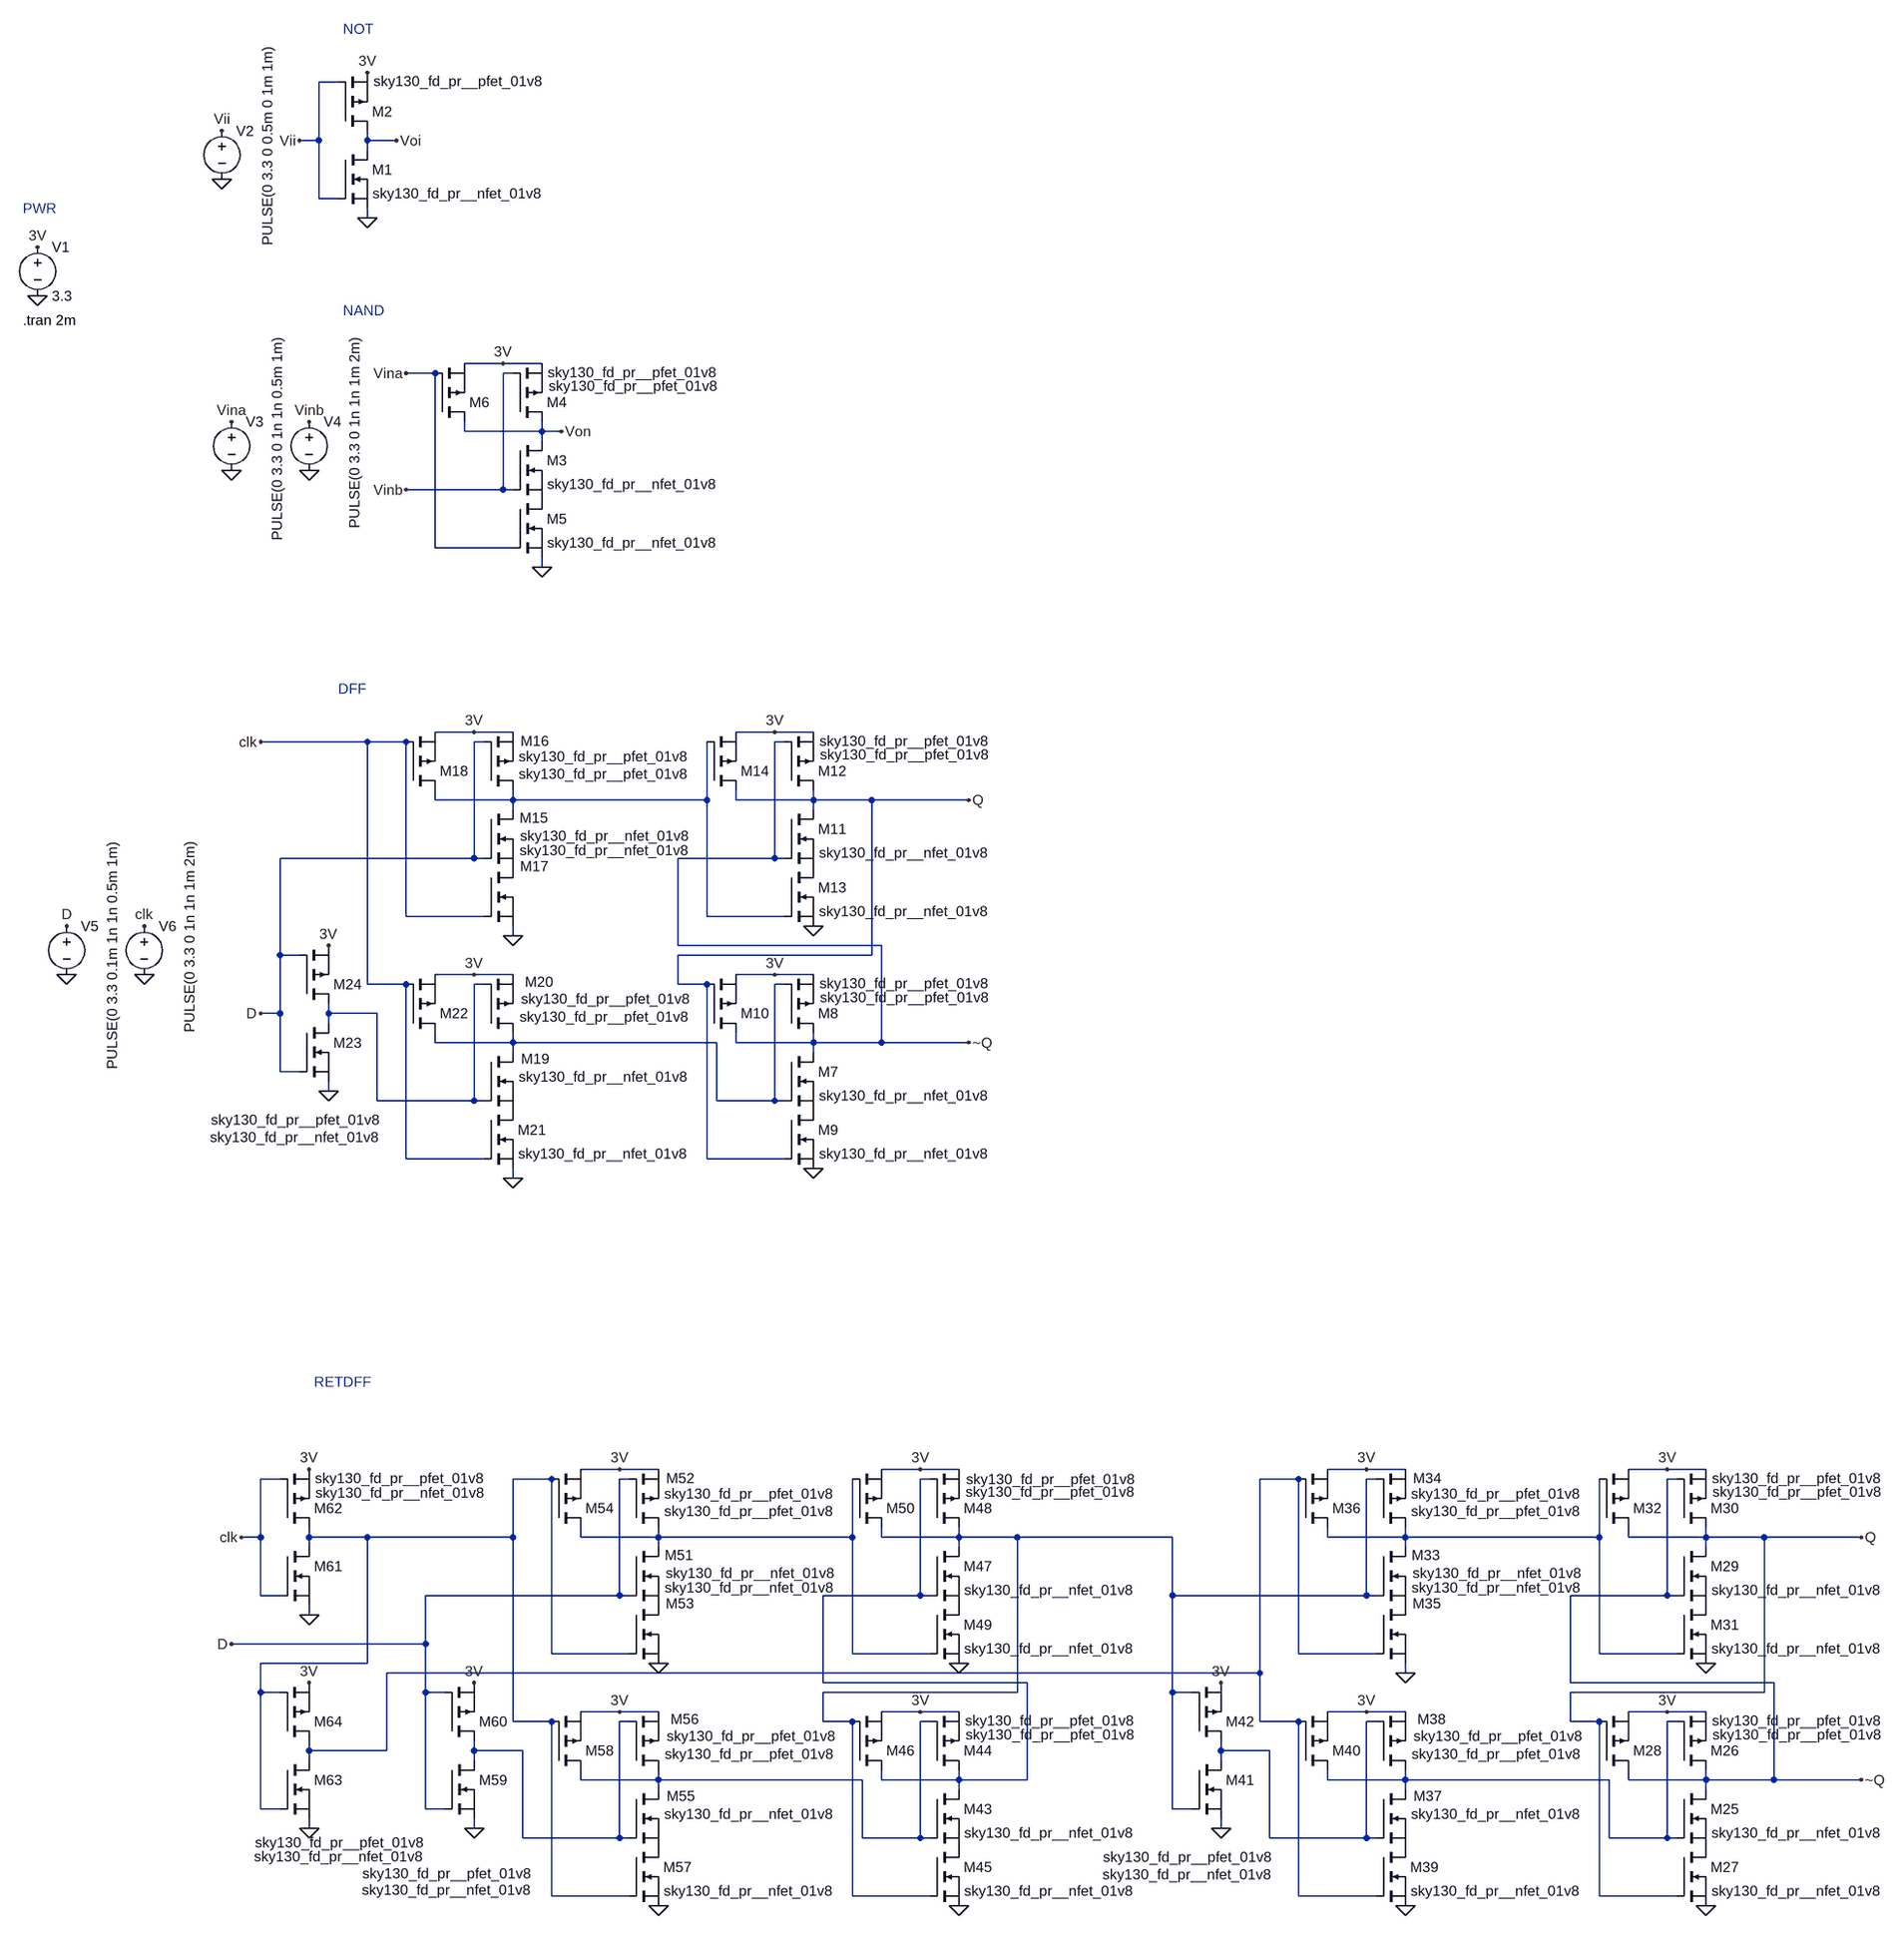
[diagram p0: schematic Digital.asc]
Digital.asc, the LTspice schematic file:
Version 4
SHEET 1 2436 2916
WIRE -144 -112 -176 -112
WIRE -176 -16 -176 -112
WIRE -176 -16 -208 -16
WIRE -96 -16 -96 -32
WIRE -48 -16 -96 -16
WIRE -96 0 -96 -16
WIRE -176 80 -176 -16
WIRE -144 80 -176 80
WIRE -96 112 -96 96
WIRE 128 352 64 352
WIRE 192 352 128 352
WIRE 16 368 -32 368
WIRE 144 368 128 368
WIRE 64 464 64 448
WIRE 192 464 192 448
WIRE 192 464 64 464
WIRE 224 464 192 464
WIRE 192 480 192 464
WIRE 128 560 128 368
WIRE 128 560 -32 560
WIRE 144 560 128 560
WIRE 16 656 16 368
WIRE 144 656 16 656
WIRE 192 688 192 672
WIRE 80 960 16 960
WIRE 144 960 80 960
WIRE 576 960 512 960
WIRE 640 960 576 960
WIRE -96 976 -272 976
WIRE -32 976 -96 976
WIRE 96 976 80 976
WIRE 592 976 576 976
WIRE 16 1072 16 1056
WIRE 144 1072 144 1056
WIRE 144 1072 16 1072
WIRE 464 1072 464 976
WIRE 464 1072 144 1072
WIRE 512 1072 512 1056
WIRE 640 1072 640 1056
WIRE 640 1072 512 1072
WIRE 736 1072 640 1072
WIRE 896 1072 736 1072
WIRE 144 1088 144 1072
WIRE 640 1088 640 1072
WIRE 80 1168 80 976
WIRE 80 1168 -240 1168
WIRE 96 1168 80 1168
WIRE 576 1168 576 976
WIRE 576 1168 416 1168
WIRE 592 1168 576 1168
WIRE -32 1264 -32 976
WIRE 96 1264 -32 1264
WIRE 464 1264 464 1072
WIRE 592 1264 464 1264
WIRE 144 1296 144 1280
WIRE 416 1312 416 1168
WIRE 752 1312 416 1312
WIRE -240 1328 -240 1168
WIRE -208 1328 -240 1328
WIRE 736 1328 736 1072
WIRE 736 1328 416 1328
WIRE 80 1360 16 1360
WIRE 144 1360 80 1360
WIRE 576 1360 512 1360
WIRE 640 1360 576 1360
WIRE -96 1376 -96 976
WIRE -32 1376 -96 1376
WIRE 96 1376 80 1376
WIRE 416 1376 416 1328
WIRE 464 1376 416 1376
WIRE 592 1376 576 1376
WIRE -240 1424 -240 1328
WIRE -240 1424 -272 1424
WIRE -160 1424 -160 1408
WIRE -80 1424 -160 1424
WIRE -160 1440 -160 1424
WIRE 16 1472 16 1456
WIRE 144 1472 144 1456
WIRE 144 1472 16 1472
WIRE 480 1472 144 1472
WIRE 512 1472 512 1456
WIRE 640 1472 640 1456
WIRE 640 1472 512 1472
WIRE 752 1472 752 1312
WIRE 752 1472 640 1472
WIRE 896 1472 752 1472
WIRE 144 1488 144 1472
WIRE 640 1488 640 1472
WIRE -240 1520 -240 1424
WIRE -208 1520 -240 1520
WIRE -160 1552 -160 1536
WIRE -80 1568 -80 1424
WIRE 80 1568 80 1376
WIRE 80 1568 -80 1568
WIRE 96 1568 80 1568
WIRE 480 1568 480 1472
WIRE 576 1568 576 1376
WIRE 576 1568 480 1568
WIRE 592 1568 576 1568
WIRE -32 1664 -32 1376
WIRE 96 1664 -32 1664
WIRE 464 1664 464 1376
WIRE 592 1664 464 1664
WIRE 144 1696 144 1680
WIRE 320 2176 256 2176
WIRE 384 2176 320 2176
WIRE 816 2176 752 2176
WIRE 880 2176 816 2176
WIRE 1552 2176 1488 2176
WIRE 1616 2176 1552 2176
WIRE 2048 2176 1984 2176
WIRE 2112 2176 2048 2176
WIRE -240 2192 -272 2192
WIRE 208 2192 144 2192
WIRE 336 2192 320 2192
WIRE 832 2192 816 2192
WIRE 1440 2192 1376 2192
WIRE 1568 2192 1552 2192
WIRE 2064 2192 2048 2192
WIRE -272 2288 -272 2192
WIRE -272 2288 -304 2288
WIRE -192 2288 -192 2272
WIRE -96 2288 -192 2288
WIRE 144 2288 144 2192
WIRE 144 2288 -96 2288
WIRE 256 2288 256 2272
WIRE 384 2288 384 2272
WIRE 384 2288 256 2288
WIRE 704 2288 704 2192
WIRE 704 2288 384 2288
WIRE 752 2288 752 2272
WIRE 880 2288 880 2272
WIRE 880 2288 752 2288
WIRE 976 2288 880 2288
WIRE 1232 2288 976 2288
WIRE 1488 2288 1488 2272
WIRE 1616 2288 1616 2272
WIRE 1616 2288 1488 2288
WIRE 1936 2288 1936 2192
WIRE 1936 2288 1616 2288
WIRE 1984 2288 1984 2272
WIRE 2112 2288 2112 2272
WIRE 2112 2288 1984 2288
WIRE 2208 2288 2112 2288
WIRE 2368 2288 2208 2288
WIRE -192 2304 -192 2288
WIRE 384 2304 384 2288
WIRE 880 2304 880 2288
WIRE 1616 2304 1616 2288
WIRE 2112 2304 2112 2288
WIRE -272 2384 -272 2288
WIRE -240 2384 -272 2384
WIRE 320 2384 320 2192
WIRE 320 2384 0 2384
WIRE 336 2384 320 2384
WIRE 816 2384 816 2192
WIRE 816 2384 656 2384
WIRE 832 2384 816 2384
WIRE 1232 2384 1232 2288
WIRE 1552 2384 1552 2192
WIRE 1552 2384 1232 2384
WIRE 1568 2384 1552 2384
WIRE 2048 2384 2048 2192
WIRE 2048 2384 1888 2384
WIRE 2064 2384 2048 2384
WIRE -192 2416 -192 2400
WIRE 0 2464 0 2384
WIRE 0 2464 -320 2464
WIRE 208 2480 208 2192
WIRE 336 2480 208 2480
WIRE 704 2480 704 2288
WIRE 832 2480 704 2480
WIRE 1440 2480 1440 2192
WIRE 1568 2480 1440 2480
WIRE 1936 2480 1936 2288
WIRE 2064 2480 1936 2480
WIRE -96 2496 -96 2288
WIRE -96 2496 -272 2496
WIRE 1376 2512 1376 2192
WIRE 1376 2512 -64 2512
WIRE 1616 2512 1616 2496
WIRE 656 2528 656 2384
WIRE 992 2528 656 2528
WIRE 1888 2528 1888 2384
WIRE 2224 2528 1888 2528
WIRE -272 2544 -272 2496
WIRE -240 2544 -272 2544
WIRE 0 2544 0 2464
WIRE 32 2544 0 2544
WIRE 976 2544 976 2288
WIRE 976 2544 656 2544
WIRE 1232 2544 1232 2384
WIRE 1264 2544 1232 2544
WIRE 2208 2544 2208 2288
WIRE 2208 2544 1888 2544
WIRE 320 2576 256 2576
WIRE 384 2576 320 2576
WIRE 816 2576 752 2576
WIRE 880 2576 816 2576
WIRE 1552 2576 1488 2576
WIRE 1616 2576 1552 2576
WIRE 2048 2576 1984 2576
WIRE 2112 2576 2048 2576
WIRE 144 2592 144 2288
WIRE 208 2592 144 2592
WIRE 336 2592 320 2592
WIRE 656 2592 656 2544
WIRE 704 2592 656 2592
WIRE 832 2592 816 2592
WIRE 1376 2592 1376 2512
WIRE 1440 2592 1376 2592
WIRE 1568 2592 1552 2592
WIRE 1888 2592 1888 2544
WIRE 1936 2592 1888 2592
WIRE 2064 2592 2048 2592
WIRE -192 2640 -192 2624
WIRE -64 2640 -64 2512
WIRE -64 2640 -192 2640
WIRE 80 2640 80 2624
WIRE 160 2640 80 2640
WIRE 1312 2640 1312 2624
WIRE 1392 2640 1312 2640
WIRE -192 2656 -192 2640
WIRE 80 2656 80 2640
WIRE 1312 2656 1312 2640
WIRE 256 2688 256 2672
WIRE 384 2688 384 2672
WIRE 384 2688 256 2688
WIRE 720 2688 384 2688
WIRE 752 2688 752 2672
WIRE 880 2688 880 2672
WIRE 880 2688 752 2688
WIRE 992 2688 992 2528
WIRE 992 2688 880 2688
WIRE 1488 2688 1488 2672
WIRE 1616 2688 1616 2672
WIRE 1616 2688 1488 2688
WIRE 1952 2688 1616 2688
WIRE 1984 2688 1984 2672
WIRE 2112 2688 2112 2672
WIRE 2112 2688 1984 2688
WIRE 2224 2688 2224 2528
WIRE 2224 2688 2112 2688
WIRE 2368 2688 2224 2688
WIRE 384 2704 384 2688
WIRE 880 2704 880 2688
WIRE 1616 2704 1616 2688
WIRE 2112 2704 2112 2688
WIRE -272 2736 -272 2544
WIRE -240 2736 -272 2736
WIRE 0 2736 0 2544
WIRE 32 2736 0 2736
WIRE 1232 2736 1232 2544
WIRE 1264 2736 1232 2736
WIRE -192 2768 -192 2752
WIRE 80 2768 80 2752
WIRE 1312 2768 1312 2752
WIRE 160 2784 160 2640
WIRE 320 2784 320 2592
WIRE 320 2784 160 2784
WIRE 336 2784 320 2784
WIRE 720 2784 720 2688
WIRE 816 2784 816 2592
WIRE 816 2784 720 2784
WIRE 832 2784 816 2784
WIRE 1392 2784 1392 2640
WIRE 1552 2784 1552 2592
WIRE 1552 2784 1392 2784
WIRE 1568 2784 1552 2784
WIRE 1952 2784 1952 2688
WIRE 2048 2784 2048 2592
WIRE 2048 2784 1952 2784
WIRE 2064 2784 2048 2784
WIRE 208 2880 208 2592
WIRE 336 2880 208 2880
WIRE 704 2880 704 2592
WIRE 832 2880 704 2880
WIRE 1440 2880 1440 2592
WIRE 1568 2880 1440 2880
WIRE 1936 2880 1936 2592
WIRE 2064 2880 1936 2880
FLAG -208 -16 Vii
FLAG -96 -128 3V
FLAG -48 -16 Voi
FLAG -96 112 0
FLAG -640 240 0
FLAG -640 160 3V
FLAG -336 48 0
FLAG -336 -32 Vii
FLAG -32 368 Vina
FLAG 128 352 3V
FLAG 224 464 Von
FLAG 192 688 0
FLAG -320 528 0
FLAG -320 448 Vina
FLAG -192 528 0
FLAG -192 448 Vinb
FLAG -32 560 Vinb
FLAG 576 1360 3V
FLAG 896 1472 ~Q
FLAG 640 1680 0
FLAG 576 960 3V
FLAG 896 1072 Q
FLAG 640 1280 0
FLAG 80 960 3V
FLAG 144 1296 0
FLAG 80 1360 3V
FLAG 144 1696 0
FLAG -272 1424 D
FLAG -160 1312 3V
FLAG -160 1552 0
FLAG -272 976 clk
FLAG -592 1360 0
FLAG -592 1280 D
FLAG -464 1360 0
FLAG -464 1280 clk
FLAG 2048 2576 3V
FLAG 2368 2688 ~Q
FLAG 2112 2896 0
FLAG 2048 2176 3V
FLAG 2368 2288 Q
FLAG 2112 2496 0
FLAG 1552 2176 3V
FLAG 1616 2512 0
FLAG 1552 2576 3V
FLAG 1616 2896 0
FLAG 1312 2528 3V
FLAG 1312 2768 0
FLAG 816 2576 3V
FLAG 880 2896 0
FLAG 816 2176 3V
FLAG 880 2496 0
FLAG 320 2176 3V
FLAG 320 2576 3V
FLAG 384 2896 0
FLAG -320 2464 D
FLAG 80 2528 3V
FLAG 80 2768 0
FLAG -192 2176 3V
FLAG -192 2416 0
FLAG -192 2528 3V
FLAG -192 2768 0
FLAG -304 2288 clk
FLAG 384 2496 0
SYMBOL nmos -144 0 R0
WINDOW 3 57 71 Left 2
SYMATTR Value sky130_fd_pr__nfet_01v8
SYMATTR InstName M1
SYMBOL pmos -144 -32 M180
WINDOW 3 58 82 Left 2
SYMATTR Value sky130_fd_pr__pfet_01v8
SYMATTR InstName M2
SYMBOL voltage -640 144 R0
WINDOW 123 0 0 Left 0
WINDOW 39 0 0 Left 0
SYMATTR InstName V1
SYMATTR Value 3.3
SYMBOL voltage -336 -48 R0
WINDOW 3 75 -125 VRight 2
WINDOW 123 0 0 Left 0
WINDOW 39 0 0 Left 0
SYMATTR Value PULSE(0 3.3 0 0.5m 0 1m 1m)
SYMATTR InstName V2
SYMBOL nmos 144 480 R0
WINDOW 3 57 71 Left 2
SYMATTR Value sky130_fd_pr__nfet_01v8
SYMATTR InstName M3
SYMBOL pmos 144 448 M180
WINDOW 3 58 82 Left 2
SYMATTR Value sky130_fd_pr__pfet_01v8
SYMATTR InstName M4
SYMBOL nmos 144 576 R0
WINDOW 3 57 71 Left 2
SYMATTR Value sky130_fd_pr__nfet_01v8
SYMATTR InstName M5
SYMBOL pmos 16 448 M180
WINDOW 3 187 59 Left 2
SYMATTR Value sky130_fd_pr__pfet_01v8
SYMATTR InstName M6
SYMBOL voltage -320 432 R0
WINDOW 3 75 -125 VRight 2
WINDOW 123 0 0 Left 0
WINDOW 39 0 0 Left 0
SYMATTR Value PULSE(0 3.3 0 1n 1n 0.5m 1m)
SYMATTR InstName V3
SYMBOL voltage -192 432 R0
WINDOW 3 75 -125 VRight 2
WINDOW 123 0 0 Left 0
WINDOW 39 0 0 Left 0
SYMATTR Value PULSE(0 3.3 0 1n 1n 1m 2m)
SYMATTR InstName V4
SYMBOL nmos 592 1488 R0
WINDOW 3 57 71 Left 2
SYMATTR Value sky130_fd_pr__nfet_01v8
SYMATTR InstName M7
SYMBOL pmos 592 1456 M180
WINDOW 3 58 82 Left 2
SYMATTR Value sky130_fd_pr__pfet_01v8
SYMATTR InstName M8
SYMBOL nmos 592 1584 R0
WINDOW 3 57 71 Left 2
SYMATTR Value sky130_fd_pr__nfet_01v8
SYMATTR InstName M9
SYMBOL pmos 464 1456 M180
WINDOW 3 187 59 Left 2
SYMATTR Value sky130_fd_pr__pfet_01v8
SYMATTR InstName M10
SYMBOL nmos 592 1088 R0
WINDOW 3 57 71 Left 2
SYMATTR Value sky130_fd_pr__nfet_01v8
SYMATTR InstName M11
SYMBOL pmos 592 1056 M180
WINDOW 3 58 82 Left 2
SYMATTR Value sky130_fd_pr__pfet_01v8
SYMATTR InstName M12
SYMBOL nmos 592 1184 R0
WINDOW 3 57 71 Left 2
SYMATTR Value sky130_fd_pr__nfet_01v8
SYMATTR InstName M13
SYMBOL pmos 464 1056 M180
WINDOW 3 187 59 Left 2
SYMATTR Value sky130_fd_pr__pfet_01v8
SYMATTR InstName M14
SYMBOL nmos 96 1088 R0
WINDOW 3 60 43 Left 2
WINDOW 0 59 13 Left 2
SYMATTR Value sky130_fd_pr__nfet_01v8
SYMATTR InstName M15
SYMBOL pmos 96 1056 M180
WINDOW 3 58 56 Left 2
WINDOW 0 61 82 Left 2
SYMATTR Value sky130_fd_pr__pfet_01v8
SYMATTR InstName M16
SYMBOL nmos 96 1184 R0
WINDOW 3 59 -29 Left 2
WINDOW 0 60 -3 Left 2
SYMATTR Value sky130_fd_pr__nfet_01v8
SYMATTR InstName M17
SYMBOL pmos -32 1056 M180
WINDOW 3 186 27 Left 2
SYMATTR Value sky130_fd_pr__pfet_01v8
SYMATTR InstName M18
SYMBOL nmos 96 1488 R0
WINDOW 3 58 40 Left 2
WINDOW 0 62 11 Left 2
SYMATTR Value sky130_fd_pr__nfet_01v8
SYMATTR InstName M19
SYMBOL pmos 96 1456 M180
WINDOW 3 62 56 Left 2
WINDOW 0 68 84 Left 2
SYMATTR Value sky130_fd_pr__pfet_01v8
SYMATTR InstName M20
SYMBOL nmos 96 1584 R0
WINDOW 3 57 71 Left 2
SYMATTR Value sky130_fd_pr__nfet_01v8
SYMATTR InstName M21
SYMBOL pmos -32 1456 M180
WINDOW 3 187 27 Left 2
SYMATTR Value sky130_fd_pr__pfet_01v8
SYMATTR InstName M22
SYMBOL nmos -208 1440 R0
WINDOW 3 -147 188 Left 2
SYMATTR Value sky130_fd_pr__nfet_01v8
SYMATTR InstName M23
SYMBOL pmos -208 1408 M180
WINDOW 3 -146 -191 Left 2
SYMATTR Value sky130_fd_pr__pfet_01v8
SYMATTR InstName M24
SYMBOL voltage -592 1264 R0
WINDOW 3 75 -125 VRight 2
WINDOW 123 0 0 Left 0
WINDOW 39 0 0 Left 0
SYMATTR Value PULSE(0 3.3 0.1m 1n 1n 0.5m 1m)
SYMATTR InstName V5
SYMBOL voltage -464 1264 R0
WINDOW 3 75 -125 VRight 2
WINDOW 123 0 0 Left 0
WINDOW 39 0 0 Left 0
SYMATTR Value PULSE(0 3.3 0 1n 1n 1m 2m)
SYMATTR InstName V6
SYMBOL nmos 2064 2704 R0
WINDOW 3 57 71 Left 2
SYMATTR Value sky130_fd_pr__nfet_01v8
SYMATTR InstName M25
SYMBOL pmos 2064 2672 M180
WINDOW 3 58 82 Left 2
SYMATTR Value sky130_fd_pr__pfet_01v8
SYMATTR InstName M26
SYMBOL nmos 2064 2800 R0
WINDOW 3 57 71 Left 2
SYMATTR Value sky130_fd_pr__nfet_01v8
SYMATTR InstName M27
SYMBOL pmos 1936 2672 M180
WINDOW 3 187 59 Left 2
SYMATTR Value sky130_fd_pr__pfet_01v8
SYMATTR InstName M28
SYMBOL nmos 2064 2304 R0
WINDOW 3 57 71 Left 2
SYMATTR Value sky130_fd_pr__nfet_01v8
SYMATTR InstName M29
SYMBOL pmos 2064 2272 M180
WINDOW 3 58 82 Left 2
SYMATTR Value sky130_fd_pr__pfet_01v8
SYMATTR InstName M30
SYMBOL nmos 2064 2400 R0
WINDOW 3 57 71 Left 2
SYMATTR Value sky130_fd_pr__nfet_01v8
SYMATTR InstName M31
SYMBOL pmos 1936 2272 M180
WINDOW 3 187 59 Left 2
SYMATTR Value sky130_fd_pr__pfet_01v8
SYMATTR InstName M32
SYMBOL nmos 1568 2304 R0
WINDOW 3 60 43 Left 2
WINDOW 0 59 13 Left 2
SYMATTR Value sky130_fd_pr__nfet_01v8
SYMATTR InstName M33
SYMBOL pmos 1568 2272 M180
WINDOW 3 58 56 Left 2
WINDOW 0 61 82 Left 2
SYMATTR Value sky130_fd_pr__pfet_01v8
SYMATTR InstName M34
SYMBOL nmos 1568 2400 R0
WINDOW 3 59 -29 Left 2
WINDOW 0 60 -3 Left 2
SYMATTR Value sky130_fd_pr__nfet_01v8
SYMATTR InstName M35
SYMBOL pmos 1440 2272 M180
WINDOW 3 186 27 Left 2
SYMATTR Value sky130_fd_pr__pfet_01v8
SYMATTR InstName M36
SYMBOL nmos 1568 2704 R0
WINDOW 3 58 40 Left 2
WINDOW 0 62 11 Left 2
SYMATTR Value sky130_fd_pr__nfet_01v8
SYMATTR InstName M37
SYMBOL pmos 1568 2672 M180
WINDOW 3 62 56 Left 2
WINDOW 0 68 84 Left 2
SYMATTR Value sky130_fd_pr__pfet_01v8
SYMATTR InstName M38
SYMBOL nmos 1568 2800 R0
WINDOW 3 57 71 Left 2
SYMATTR Value sky130_fd_pr__nfet_01v8
SYMATTR InstName M39
SYMBOL pmos 1440 2672 M180
WINDOW 3 187 27 Left 2
SYMATTR Value sky130_fd_pr__pfet_01v8
SYMATTR InstName M40
SYMBOL nmos 1264 2656 R0
WINDOW 3 -147 188 Left 2
SYMATTR Value sky130_fd_pr__nfet_01v8
SYMATTR InstName M41
SYMBOL pmos 1264 2624 M180
WINDOW 3 -146 -191 Left 2
SYMATTR Value sky130_fd_pr__pfet_01v8
SYMATTR InstName M42
SYMBOL nmos 832 2704 R0
WINDOW 3 57 71 Left 2
SYMATTR Value sky130_fd_pr__nfet_01v8
SYMATTR InstName M43
SYMBOL pmos 832 2672 M180
WINDOW 3 58 82 Left 2
SYMATTR Value sky130_fd_pr__pfet_01v8
SYMATTR InstName M44
SYMBOL nmos 832 2800 R0
WINDOW 3 57 71 Left 2
SYMATTR Value sky130_fd_pr__nfet_01v8
SYMATTR InstName M45
SYMBOL pmos 704 2672 M180
WINDOW 3 187 59 Left 2
SYMATTR Value sky130_fd_pr__pfet_01v8
SYMATTR InstName M46
SYMBOL nmos 832 2304 R0
WINDOW 3 57 71 Left 2
SYMATTR Value sky130_fd_pr__nfet_01v8
SYMATTR InstName M47
SYMBOL pmos 832 2272 M180
WINDOW 3 60 80 Left 2
SYMATTR Value sky130_fd_pr__pfet_01v8
SYMATTR InstName M48
SYMBOL nmos 832 2400 R0
WINDOW 3 57 71 Left 2
SYMATTR Value sky130_fd_pr__nfet_01v8
SYMATTR InstName M49
SYMBOL pmos 704 2272 M180
WINDOW 3 187 59 Left 2
SYMATTR Value sky130_fd_pr__pfet_01v8
SYMATTR InstName M50
SYMBOL nmos 336 2304 R0
WINDOW 3 60 43 Left 2
WINDOW 0 59 13 Left 2
SYMATTR Value sky130_fd_pr__nfet_01v8
SYMATTR InstName M51
SYMBOL pmos 336 2272 M180
WINDOW 3 58 56 Left 2
WINDOW 0 61 82 Left 2
SYMATTR Value sky130_fd_pr__pfet_01v8
SYMATTR InstName M52
SYMBOL nmos 336 2400 R0
WINDOW 3 59 -29 Left 2
WINDOW 0 60 -3 Left 2
SYMATTR Value sky130_fd_pr__nfet_01v8
SYMATTR InstName M53
SYMBOL pmos 208 2272 M180
WINDOW 3 186 27 Left 2
SYMATTR Value sky130_fd_pr__pfet_01v8
SYMATTR InstName M54
SYMBOL nmos 336 2704 R0
WINDOW 3 58 40 Left 2
WINDOW 0 62 11 Left 2
SYMATTR Value sky130_fd_pr__nfet_01v8
SYMATTR InstName M55
SYMBOL pmos 336 2672 M180
WINDOW 3 62 56 Left 2
WINDOW 0 68 84 Left 2
SYMATTR Value sky130_fd_pr__pfet_01v8
SYMATTR InstName M56
SYMBOL nmos 336 2800 R0
WINDOW 3 57 71 Left 2
SYMATTR Value sky130_fd_pr__nfet_01v8
SYMATTR InstName M57
SYMBOL pmos 208 2672 M180
WINDOW 3 187 27 Left 2
SYMATTR Value sky130_fd_pr__pfet_01v8
SYMATTR InstName M58
SYMBOL nmos 32 2656 R0
WINDOW 3 -137 213 Left 2
SYMATTR Value sky130_fd_pr__nfet_01v8
SYMATTR InstName M59
SYMBOL pmos 32 2624 M180
WINDOW 3 -136 -218 Left 2
SYMATTR Value sky130_fd_pr__pfet_01v8
SYMATTR InstName M60
SYMBOL nmos -240 2304 R0
WINDOW 3 59 -90 Left 2
SYMATTR Value sky130_fd_pr__nfet_01v8
SYMATTR InstName M61
SYMBOL pmos -240 2272 M180
WINDOW 3 58 82 Left 2
SYMATTR Value sky130_fd_pr__pfet_01v8
SYMATTR InstName M62
SYMBOL nmos -240 2656 R0
WINDOW 3 -43 158 Left 2
SYMATTR Value sky130_fd_pr__nfet_01v8
SYMATTR InstName M63
SYMBOL pmos -240 2624 M180
WINDOW 3 -41 -167 Left 2
SYMATTR Value sky130_fd_pr__pfet_01v8
SYMATTR InstName M64
TEXT -664 280 Left 2 !.tran 2m
TEXT -664 96 Left 2 ;PWR
TEXT -136 -200 Left 2 ;NOT
TEXT -136 264 Left 2 ;NAND
TEXT -144 888 Left 2 ;DFF
TEXT -184 2032 Left 2 ;RETDFF

The netlist it stands for:
* Digital.asc
M1 Voi Vii 0 0 sky130_fd_pr__nfet_01v8
M2 Voi Vii 3V 3V sky130_fd_pr__pfet_01v8
V1 3V 0 3.3
V2 Vii 0 PULSE(0 3.3 0 0.5m 0 1m 1m)
M3 Von Vinb P001 P001 sky130_fd_pr__nfet_01v8
M4 Von Vinb 3V 3V sky130_fd_pr__pfet_01v8
M5 P001 Vina 0 0 sky130_fd_pr__nfet_01v8
M6 Von Vina 3V 3V sky130_fd_pr__pfet_01v8
V3 Vina 0 PULSE(0 3.3 0 1n 1n 0.5m 1m)
V4 Vinb 0 PULSE(0 3.3 0 1n 1n 1m 2m)
M7 ~Q N003 P002 P002 sky130_fd_pr__nfet_01v8
M8 ~Q N003 3V 3V sky130_fd_pr__pfet_01v8
M9 P002 Q 0 0 sky130_fd_pr__nfet_01v8
M10 ~Q Q 3V 3V sky130_fd_pr__pfet_01v8
M11 Q ~Q P003 P003 sky130_fd_pr__nfet_01v8
M12 Q ~Q 3V 3V sky130_fd_pr__pfet_01v8
M13 P003 N001 0 0 sky130_fd_pr__nfet_01v8
M14 Q N001 3V 3V sky130_fd_pr__pfet_01v8
M15 N001 D P004 P004 sky130_fd_pr__nfet_01v8
M16 N001 D 3V 3V sky130_fd_pr__pfet_01v8
M17 P004 clk 0 0 sky130_fd_pr__nfet_01v8
M18 N001 clk 3V 3V sky130_fd_pr__pfet_01v8
M19 N003 N002 P005 P005 sky130_fd_pr__nfet_01v8
M20 N003 N002 3V 3V sky130_fd_pr__pfet_01v8
M21 P005 clk 0 0 sky130_fd_pr__nfet_01v8
M22 N003 clk 3V 3V sky130_fd_pr__pfet_01v8
M23 N002 D 0 0 sky130_fd_pr__nfet_01v8
M24 N002 D 3V 3V sky130_fd_pr__pfet_01v8
V5 D 0 PULSE(0 3.3 0.1m 1n 1n 0.5m 1m)
V6 clk 0 PULSE(0 3.3 0 1n 1n 1m 2m)
M25 ~Q N013 P006 P006 sky130_fd_pr__nfet_01v8
M26 ~Q N013 3V 3V sky130_fd_pr__pfet_01v8
M27 P006 Q 0 0 sky130_fd_pr__nfet_01v8
M28 ~Q Q 3V 3V sky130_fd_pr__pfet_01v8
M29 Q ~Q P007 P007 sky130_fd_pr__nfet_01v8
M30 Q ~Q 3V 3V sky130_fd_pr__pfet_01v8
M31 P007 N009 0 0 sky130_fd_pr__nfet_01v8
M32 Q N009 3V 3V sky130_fd_pr__pfet_01v8
M33 N009 N007 P008 P008 sky130_fd_pr__nfet_01v8
M34 N009 N007 3V 3V sky130_fd_pr__pfet_01v8
M35 P008 N006 0 0 sky130_fd_pr__nfet_01v8
M36 N009 N006 3V 3V sky130_fd_pr__pfet_01v8
M37 N013 N012 P009 P009 sky130_fd_pr__nfet_01v8
M38 N013 N012 3V 3V sky130_fd_pr__pfet_01v8
M39 P009 N006 0 0 sky130_fd_pr__nfet_01v8
M40 N013 N006 3V 3V sky130_fd_pr__pfet_01v8
M41 N012 N007 0 0 sky130_fd_pr__nfet_01v8
M42 N012 N007 3V 3V sky130_fd_pr__pfet_01v8
M43 N005 N011 P010 P010 sky130_fd_pr__nfet_01v8
M44 N005 N011 3V 3V sky130_fd_pr__pfet_01v8
M45 P010 N007 0 0 sky130_fd_pr__nfet_01v8
M46 N005 N007 3V 3V sky130_fd_pr__pfet_01v8
M47 N007 N005 P011 P011 sky130_fd_pr__nfet_01v8
M48 N007 N005 3V 3V sky130_fd_pr__pfet_01v8
M49 P011 N008 0 0 sky130_fd_pr__nfet_01v8
M50 N007 N008 3V 3V sky130_fd_pr__pfet_01v8
M51 N008 D P012 P012 sky130_fd_pr__nfet_01v8
M52 N008 D 3V 3V sky130_fd_pr__pfet_01v8
M53 P012 N004 0 0 sky130_fd_pr__nfet_01v8
M54 N008 N004 3V 3V sky130_fd_pr__pfet_01v8
M55 N011 N010 P013 P013 sky130_fd_pr__nfet_01v8
M56 N011 N010 3V 3V sky130_fd_pr__pfet_01v8
M57 P013 N004 0 0 sky130_fd_pr__nfet_01v8
M58 N011 N004 3V 3V sky130_fd_pr__pfet_01v8
M59 N010 D 0 0 sky130_fd_pr__nfet_01v8
M60 N010 D 3V 3V sky130_fd_pr__pfet_01v8
M61 N004 clk 0 0 sky130_fd_pr__nfet_01v8
M62 N004 clk 3V 3V sky130_fd_pr__pfet_01v8
M63 N006 N004 0 0 sky130_fd_pr__nfet_01v8
M64 N006 N004 3V 3V sky130_fd_pr__pfet_01v8
.model NMOS NMOS
.model PMOS PMOS
.lib standard.mos
.tran 2m
* PWR
* NOT
* NAND
* DFF
* RETDFF
.backanno
.end